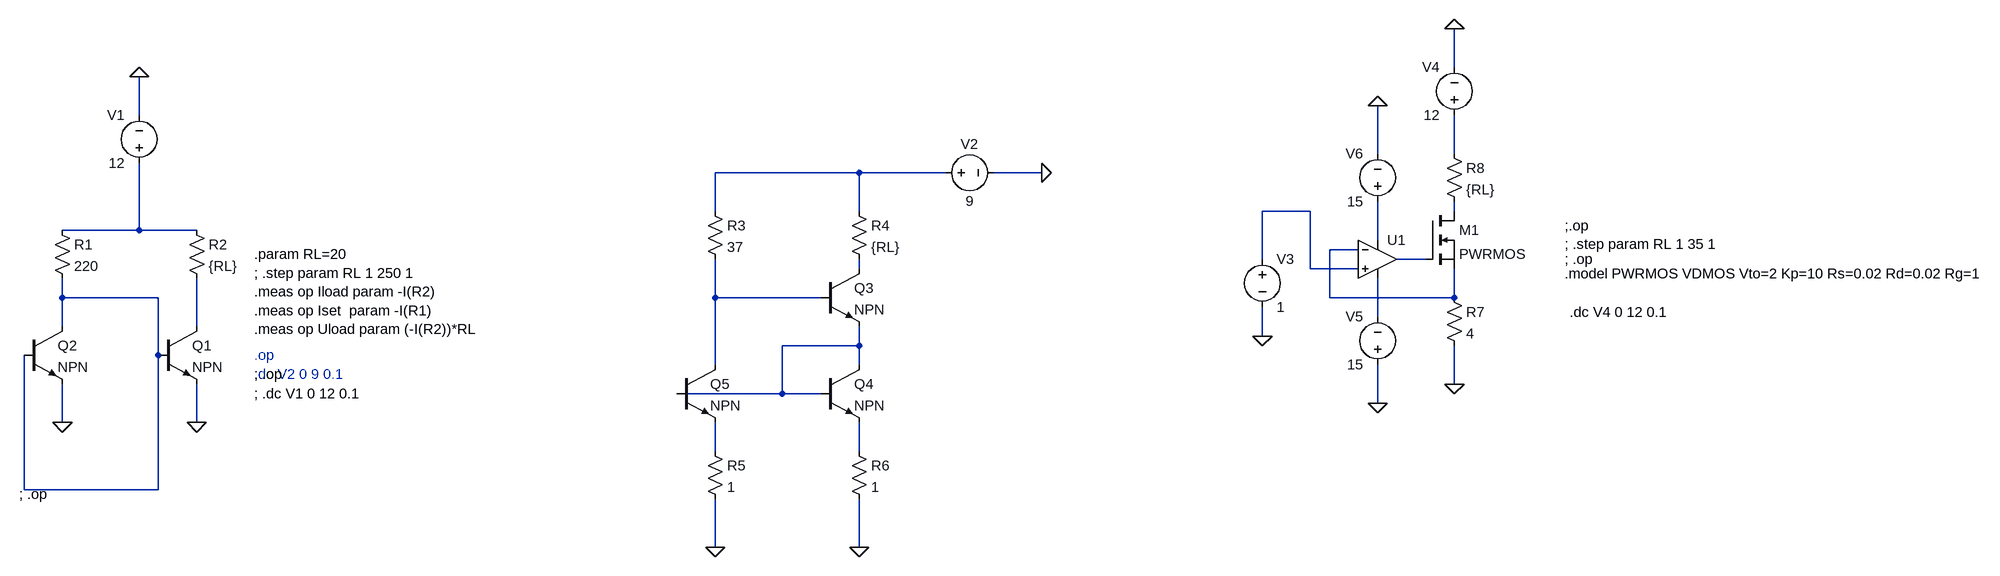
[diagram p0: schematic lab8.asc]
lab8.asc, the LTspice schematic file:
Version 4.1
SHEET 1 3336 680
WIRE 2416 -144 2416 -208
WIRE 224 -64 224 -128
WIRE 2288 0 2288 -80
WIRE 2416 0 2416 -64
WIRE 1424 32 1184 32
WIRE 1568 32 1424 32
WIRE 1728 32 1648 32
WIRE 1184 96 1184 32
WIRE 1424 96 1424 32
WIRE 2176 96 2096 96
WIRE 2416 96 2416 80
WIRE 224 128 224 16
WIRE 224 128 96 128
WIRE 320 128 224 128
WIRE 2288 144 2288 80
WIRE 2256 160 2208 160
WIRE 2096 176 2096 96
WIRE 2368 176 2320 176
WIRE 1424 192 1424 176
WIRE 2176 192 2176 96
WIRE 2256 192 2176 192
WIRE 96 240 96 208
WIRE 256 240 96 240
WIRE 1184 240 1184 176
WIRE 1360 240 1184 240
WIRE 2208 240 2208 160
WIRE 2416 240 2416 192
WIRE 2416 240 2208 240
WIRE 2288 272 2288 208
WIRE 96 288 96 240
WIRE 320 288 320 208
WIRE 2096 304 2096 256
WIRE 1424 320 1424 288
WIRE 1424 320 1296 320
WIRE 256 336 256 240
WIRE 1184 352 1184 240
WIRE 1424 352 1424 320
WIRE 2416 384 2416 320
WIRE 1296 400 1296 320
WIRE 1296 400 1120 400
WIRE 1360 400 1296 400
WIRE 2288 416 2288 352
WIRE 96 448 96 384
WIRE 320 448 320 384
WIRE 1184 496 1184 448
WIRE 1424 496 1424 448
WIRE 32 560 32 336
WIRE 256 560 256 336
WIRE 256 560 32 560
WIRE 1184 656 1184 576
WIRE 1424 656 1424 576
FLAG 224 -128 0
FLAG 96 448 0
FLAG 320 448 0
FLAG 1728 32 0
FLAG 1424 656 0
FLAG 1184 656 0
FLAG 2096 304 0
FLAG 2416 384 0
FLAG 2288 -80 0
FLAG 2416 -208 0
FLAG 2288 416 0
SYMBOL res 80 112 R0
SYMATTR InstName R1
SYMATTR Value 220
SYMBOL res 304 112 R0
SYMATTR InstName R2
SYMATTR Value {RL}
SYMBOL voltage 224 32 R180
WINDOW 0 24 96 Left 2
WINDOW 3 24 16 Left 2
SYMATTR InstName V1
SYMATTR Value 12
SYMBOL npn 256 288 R0
SYMATTR InstName Q1
SYMBOL npn 32 288 R0
SYMATTR InstName Q2
SYMBOL res 1168 80 R0
SYMATTR InstName R3
SYMATTR Value 37
SYMBOL res 1408 80 R0
SYMATTR InstName R4
SYMATTR Value {RL}
SYMBOL voltage 1552 32 R270
WINDOW 0 32 56 VTop 2
WINDOW 3 -32 56 VBottom 2
WINDOW 123 0 0 Left 0
WINDOW 39 0 0 Left 0
SYMATTR InstName V2
SYMATTR Value 9
SYMBOL npn 1360 192 R0
SYMATTR InstName Q3
SYMBOL res 1408 480 R0
SYMATTR InstName R6
SYMATTR Value 1
SYMBOL res 1168 480 R0
SYMATTR InstName R5
SYMATTR Value 1
SYMBOL npn 1360 352 R0
SYMATTR InstName Q4
SYMBOL npn 1120 352 R0
SYMATTR InstName Q5
SYMBOL OpAmps\\UniversalOpAmp2 2288 176 R0
SYMATTR InstName U1
SYMBOL voltage 2096 160 R0
SYMATTR InstName V3
SYMATTR Value 1
SYMBOL res 2400 224 R0
SYMATTR InstName R7
SYMATTR Value 4
SYMBOL res 2400 -16 R0
SYMATTR InstName R8
SYMATTR Value {RL}
SYMBOL voltage 2416 -48 R180
WINDOW 0 24 96 Left 2
WINDOW 3 24 16 Left 2
SYMATTR InstName V4
SYMATTR Value 12
SYMBOL nmos 2368 96 R0
SYMATTR InstName M1
SYMATTR Value PWRMOS
SYMBOL voltage 2288 368 R180
WINDOW 0 24 96 Left 2
WINDOW 3 24 16 Left 2
SYMATTR InstName V5
SYMATTR Value 15
SYMBOL voltage 2288 96 R180
WINDOW 0 24 96 Left 2
WINDOW 3 24 16 Left 2
SYMATTR InstName V6
SYMATTR Value 15
TEXT 24 568 Left 2 !; .op
TEXT 416 168 Left 2 !.param RL=20\n; .step param RL 1 250 1\n.meas op Iload param -I(R2)\n.meas op Iset  param -I(R1)\n.meas op Uload param (-I(R2))*RL
TEXT 416 336 Left 2 ;.op
TEXT 416 368 Left 2 ;.dc V2 0 9 0.1
TEXT 416 400 Left 2 !; .dc V1 0 12 0.1
TEXT 416 368 Left 2 !; .op
TEXT 2600 120 Left 2 !;.op\n; .step param RL 1 35 1
TEXT 2600 200 Left 2 !.model PWRMOS VDMOS Vto=2 Kp=10 Rs=0.02 Rd=0.02 Rg=1
TEXT 2608 264 Left 2 !.dc V4 0 12 0.1
TEXT 2600 176 Left 2 !; .op

The netlist it stands for:
* lab8.asc
R1 N005 N010 220
R2 N005 N013 {RL}
V1 N005 0 12
Q1 N013 N010 0 0 NPN
Q2 N010 N010 0 0 NPN
R3 N002 N011 37
R4 N002 N009 {RL}
V2 N002 0 9
Q3 N009 N011 N014 0 NPN
R6 N016 0 1
R5 N015 0 1
Q4 N014 N014 N016 0 NPN
Q5 N011 N014 N015 0 NPN
X§U1 N003 N007 N006 N012 N008 level2 Avol=1Meg GBW=10Meg Slew=10Meg Ilimit=25m Rail=0 Vos=0 En=0 Enk=0 In=0 Ink=0 Rin=500Meg  ; pins In+ In- V+ V- OUT
V3 N003 0 1
R7 N007 0 4
R8 N001 N004 {RL}
V4 N001 0 12
M1 N004 N008 N007 N007 PWRMOS
V5 0 N012 15
V6 N006 0 15
.model NPN NPN
.model PNP PNP
.lib standard.bjt
.model NMOS NMOS
.model PMOS PMOS
.lib standard.mos
; .op
.param RL=20
; .step param RL 1 250 1
.meas op Iload param -I(R2)
.meas op Iset  param -I(R1)
.meas op Uload param (-I(R2))*RL
* .op
* .dc V2 0 9 0.1
; .dc V1 0 12 0.1
; .op
;.op
; .step param RL 1 35 1
.model PWRMOS VDMOS Vto=2 Kp=10 Rs=0.02 Rd=0.02 Rg=1
.dc V4 0 12 0.1
; .op
.lib UniversalOpAmp2.lib
.backanno
.end